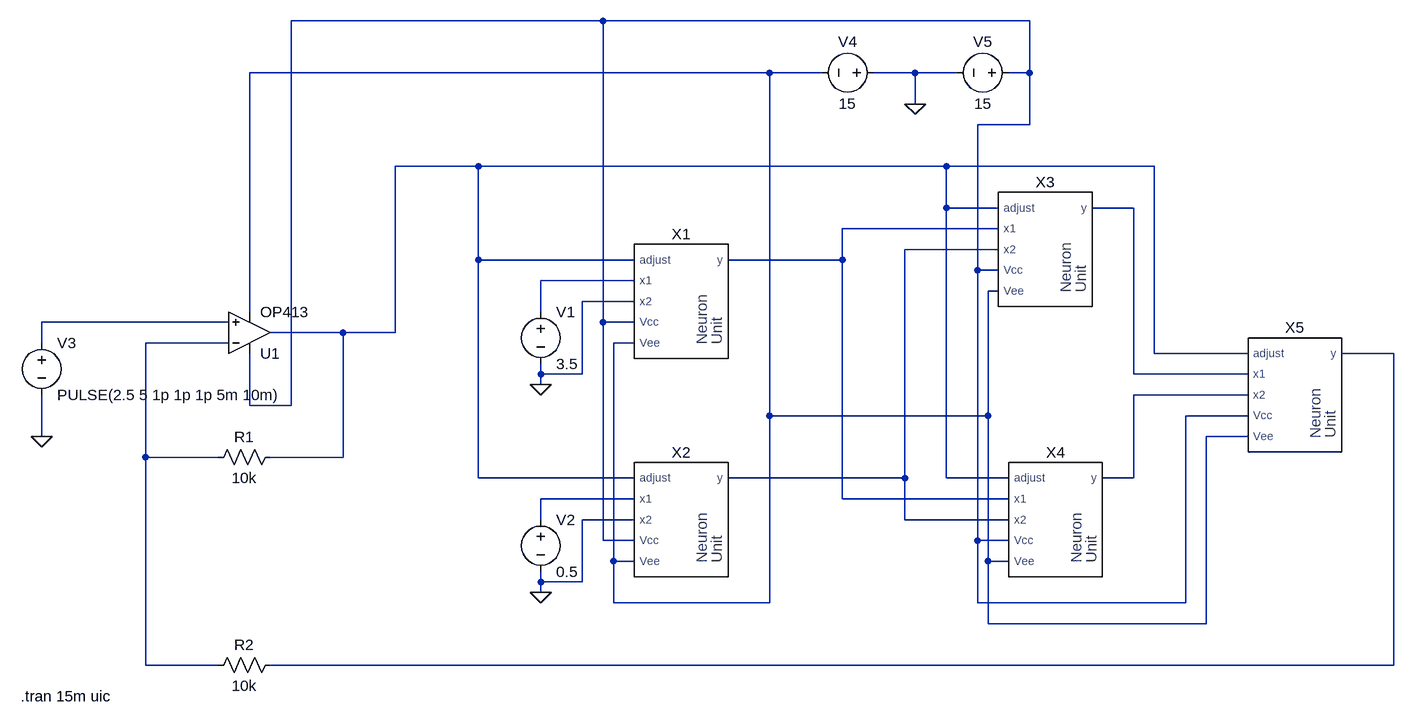
[diagram p0: schematic Network.asc]
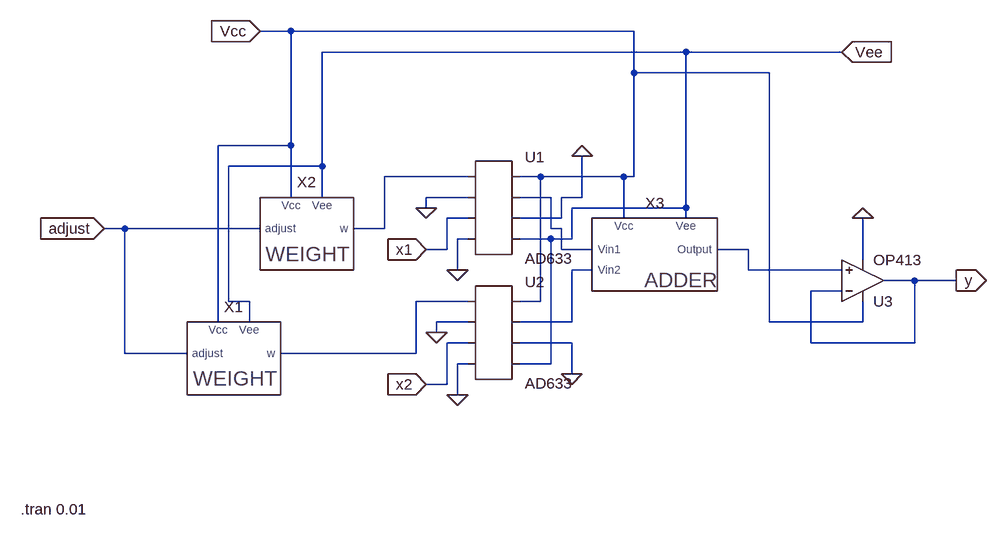
[diagram p1: sub-circuit neuron_unit.asc]
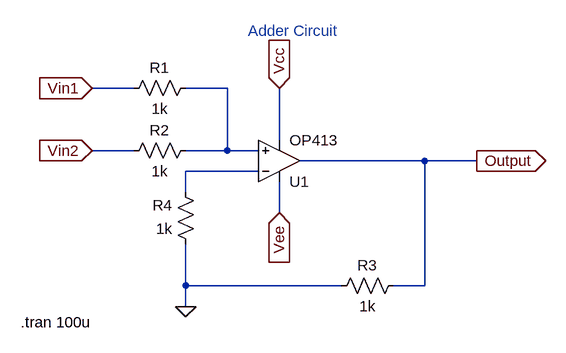
[diagram p2: sub-circuit adder.asc]
Network.asc, the LTspice schematic file:
Version 4
SHEET 1 880 680
WIRE -496 -384 -976 -384
WIRE 160 -384 -496 -384
WIRE -240 -304 -1040 -304
WIRE -160 -304 -240 -304
WIRE -16 -304 -80 -304
WIRE 48 -304 -16 -304
WIRE 160 -304 160 -384
WIRE 160 -304 128 -304
WIRE -16 -256 -16 -304
WIRE 160 -224 160 -304
WIRE 160 -224 80 -224
WIRE -688 -160 -816 -160
WIRE 32 -160 -688 -160
WIRE 352 -160 32 -160
WIRE 32 -96 32 -160
WIRE 112 -96 32 -96
WIRE 320 -96 256 -96
WIRE 112 -64 -128 -64
WIRE 112 -32 -32 -32
WIRE -688 -16 -688 -160
WIRE -448 -16 -688 -16
WIRE -128 -16 -128 -64
WIRE -128 -16 -304 -16
WIRE 80 0 80 -224
WIRE 112 0 80 0
WIRE -448 16 -592 16
WIRE 112 32 96 32
WIRE -448 48 -528 48
WIRE -1040 64 -1040 -304
WIRE -592 64 -592 16
WIRE -1072 80 -1360 80
WIRE -496 80 -496 -384
WIRE -448 80 -496 80
WIRE -896 96 -1008 96
WIRE -816 96 -816 -160
WIRE -816 96 -896 96
WIRE -1360 112 -1360 80
WIRE -1072 112 -1200 112
WIRE -448 112 -480 112
WIRE 352 128 352 -160
WIRE 496 128 352 128
WIRE 720 128 640 128
WIRE -592 160 -592 144
WIRE -528 160 -528 48
WIRE -528 160 -592 160
WIRE 320 160 320 -96
WIRE 496 160 320 160
WIRE -592 176 -592 160
WIRE 496 192 320 192
WIRE -1040 208 -1040 128
WIRE -976 208 -976 -384
WIRE -976 208 -1040 208
WIRE -240 224 -240 -304
WIRE 96 224 96 32
WIRE 96 224 -240 224
WIRE 496 224 400 224
WIRE -1360 256 -1360 192
WIRE 496 256 432 256
WIRE -1200 288 -1200 112
WIRE -1088 288 -1200 288
WIRE -896 288 -896 96
WIRE -896 288 -1008 288
WIRE -688 320 -688 -16
WIRE -448 320 -688 320
WIRE -32 320 -32 -32
WIRE -32 320 -304 320
WIRE 32 320 32 -96
WIRE 128 320 32 320
WIRE 320 320 320 192
WIRE 320 320 272 320
WIRE -448 352 -592 352
WIRE -128 352 -128 -16
WIRE 128 352 -128 352
WIRE -592 384 -592 352
WIRE -448 384 -528 384
WIRE -32 384 -32 320
WIRE 128 384 -32 384
WIRE -496 416 -496 80
WIRE -448 416 -496 416
WIRE 80 416 80 0
WIRE 128 416 80 416
WIRE -480 448 -480 112
WIRE -448 448 -480 448
WIRE 96 448 96 224
WIRE 128 448 96 448
WIRE -592 480 -592 464
WIRE -528 480 -528 384
WIRE -528 480 -592 480
WIRE -592 496 -592 480
WIRE -480 512 -480 448
WIRE -240 512 -240 224
WIRE -240 512 -480 512
WIRE 80 512 80 416
WIRE 400 512 400 224
WIRE 400 512 80 512
WIRE 96 544 96 448
WIRE 432 544 432 256
WIRE 432 544 96 544
WIRE -1200 608 -1200 288
WIRE -1088 608 -1200 608
WIRE 720 608 720 128
WIRE 720 608 -1008 608
FLAG -16 -256 0
FLAG -592 176 0
FLAG -592 496 0
FLAG -1360 256 0
SYMBOL neuron_unit -384 48 R0
SYMATTR InstName X1
SYMBOL neuron_unit -384 384 R0
SYMATTR InstName X2
SYMBOL neuron_unit 176 -32 R0
SYMATTR InstName X3
SYMBOL neuron_unit 192 384 R0
SYMATTR InstName X4
SYMBOL neuron_unit 560 192 R0
SYMATTR InstName X5
SYMBOL voltage -592 48 R0
WINDOW 123 0 0 Left 0
WINDOW 39 0 0 Left 0
SYMATTR InstName V1
SYMATTR Value 3.5
SYMBOL voltage -592 368 R0
WINDOW 123 0 0 Left 0
WINDOW 39 0 0 Left 0
SYMATTR InstName V2
SYMATTR Value 0.5
SYMBOL res -992 272 R90
WINDOW 0 0 56 VBottom 2
WINDOW 3 32 56 VTop 2
SYMATTR InstName R1
SYMATTR Value 10k
SYMBOL res -992 592 R90
WINDOW 0 0 56 VBottom 2
WINDOW 3 32 56 VTop 2
SYMATTR InstName R2
SYMATTR Value 10k
SYMBOL voltage -1360 96 R0
WINDOW 123 0 0 Left 0
WINDOW 39 0 0 Left 0
SYMATTR InstName V3
SYMATTR Value PULSE(2.5 5 1p 1p 1p 5m 10m)
SYMBOL voltage -64 -304 R90
WINDOW 0 -32 56 VBottom 2
WINDOW 3 32 56 VTop 2
WINDOW 123 0 0 Left 0
WINDOW 39 0 0 Left 0
SYMATTR InstName V4
SYMATTR Value 15
SYMBOL voltage 144 -304 R90
WINDOW 0 -32 56 VBottom 2
WINDOW 3 32 56 VTop 2
WINDOW 123 0 0 Left 0
WINDOW 39 0 0 Left 0
SYMATTR InstName V5
SYMATTR Value 15
SYMBOL OpAmps\\OP413 -1040 160 M180
SYMATTR InstName U1
TEXT -1392 656 Left 2 !.tran 15m uic

neuron_unit.asc, the sub-circuit schematic file:
Version 4
SHEET 1 1096 680
WIRE 0 -208 -48 -208
WIRE 528 -208 0 -208
WIRE 608 -176 48 -176
WIRE 848 -176 608 -176
WIRE 528 -144 528 -208
WIRE 736 -144 528 -144
WIRE 0 -32 0 -208
WIRE 0 -32 -112 -32
WIRE 48 0 48 -176
WIRE 48 0 -96 0
WIRE 272 16 144 16
WIRE 384 16 352 16
WIRE 512 16 384 16
WIRE 528 16 528 -144
WIRE 528 16 512 16
WIRE 0 48 0 -32
WIRE 48 48 48 0
WIRE 272 48 208 48
WIRE 400 48 352 48
WIRE 448 48 448 -16
WIRE 448 48 416 48
WIRE 208 64 208 48
WIRE 608 64 608 -176
WIRE 608 64 432 64
WIRE 272 80 240 80
WIRE 416 80 416 48
WIRE 416 80 352 80
WIRE 512 80 512 16
WIRE 608 80 608 64
WIRE -256 96 -288 96
WIRE -48 96 -256 96
WIRE 144 96 144 16
WIRE 144 96 96 96
WIRE 400 96 400 48
WIRE 416 96 400 96
WIRE 272 112 256 112
WIRE 400 112 352 112
WIRE 432 112 432 64
WIRE 432 112 400 112
WIRE 240 128 240 80
WIRE 240 128 208 128
WIRE 416 128 416 96
WIRE 464 128 416 128
WIRE 704 128 656 128
WIRE 880 144 880 80
WIRE 256 160 256 112
WIRE 464 160 432 160
WIRE 704 160 704 128
WIRE 848 160 704 160
WIRE 960 176 912 176
WIRE 1024 176 960 176
WIRE 848 192 800 192
WIRE -96 208 -96 0
WIRE -64 208 -96 208
WIRE 272 208 192 208
WIRE 384 208 384 16
WIRE 384 208 352 208
WIRE -112 240 -112 -32
WIRE -64 240 -64 208
WIRE 272 240 224 240
WIRE 432 240 432 160
WIRE 432 240 352 240
WIRE 736 240 736 -144
WIRE 880 240 880 208
WIRE 880 240 736 240
WIRE 224 256 224 240
WIRE 272 272 240 272
WIRE 432 272 352 272
WIRE 800 272 800 192
WIRE 960 272 960 176
WIRE 960 272 800 272
WIRE -256 288 -256 96
WIRE -160 288 -256 288
WIRE 192 288 192 208
WIRE 192 288 -16 288
WIRE 272 304 256 304
WIRE 400 304 400 112
WIRE 400 304 352 304
WIRE 432 320 432 272
WIRE 240 336 240 272
WIRE 240 336 208 336
WIRE 256 352 256 304
FLAG -48 -208 Vcc
IOPIN -48 -208 In
FLAG 848 -176 Vee
IOPIN 848 -176 In
FLAG 208 64 0
FLAG 224 256 0
FLAG 256 352 0
FLAG 256 160 0
FLAG 208 128 x1
IOPIN 208 128 In
FLAG 208 336 x2
IOPIN 208 336 In
FLAG -288 96 adjust
IOPIN -288 96 In
FLAG 448 -16 0
FLAG 432 320 0
FLAG 880 80 0
FLAG 1024 176 y
IOPIN 1024 176 Out
SYMBOL Weight -96 288 R0
SYMATTR InstName X1
SYMBOL Weight 16 96 R0
SYMATTR InstName X2
SYMBOL Adder 560 144 R0
SYMATTR InstName X3
SYMBOL OpAmps\\OP413 880 240 M180
SYMATTR InstName U3
SYMBOL AutoGenerated\\AD633 304 64 R0
SYMATTR InstName U1
SYMBOL AutoGenerated\\AD633 304 256 R0
SYMATTR InstName U2
TEXT -416 528 Left 2 !.tran 0.01

adder.asc, the sub-circuit schematic file:
Version 4
SHEET 1 880 680
WIRE -176 -48 -240 -48
WIRE -32 -48 -96 -48
WIRE 48 32 48 -48
WIRE -176 48 -240 48
WIRE -32 48 -32 -48
WIRE -32 48 -96 48
WIRE 16 48 -32 48
WIRE 272 64 80 64
WIRE 352 64 272 64
WIRE 16 80 -96 80
WIRE -96 112 -96 80
WIRE 48 144 48 96
WIRE -96 256 -96 192
WIRE 144 256 -96 256
WIRE 272 256 272 64
WIRE 272 256 224 256
WIRE -96 288 -96 256
FLAG -96 288 0
FLAG 352 64 Output
IOPIN 352 64 Out
FLAG -240 -48 Vin1
IOPIN -240 -48 In
FLAG -240 48 Vin2
IOPIN -240 48 In
FLAG 48 -48 Vcc
IOPIN 48 -48 In
FLAG 48 144 Vee
IOPIN 48 144 In
SYMBOL res -80 -64 R90
WINDOW 0 0 56 VBottom 2
WINDOW 3 32 56 VTop 2
SYMATTR InstName R1
SYMATTR Value 1k
SYMBOL res -80 32 R90
WINDOW 0 0 56 VBottom 2
WINDOW 3 32 56 VTop 2
SYMATTR InstName R2
SYMATTR Value 1k
SYMBOL res 240 240 R90
WINDOW 0 0 56 VBottom 2
WINDOW 3 32 56 VTop 2
SYMATTR InstName R3
SYMATTR Value 1k
SYMBOL res -80 208 R180
WINDOW 0 36 76 Left 2
WINDOW 3 36 40 Left 2
SYMATTR InstName R4
SYMATTR Value 1k
SYMBOL OpAmps\\OP413 48 128 M180
SYMATTR InstName U1
TEXT 0 -136 Left 2 ;Adder Circuit
TEXT -350 312 Left 2 !.tran 100u

The netlist it stands for:
* Network.asc
XX1 N003 N001 N002 N007 0 N005 neuron_unit
XX2 N003 N001 N002 N012 0 N006 neuron_unit
XX3 N003 N001 N002 N005 N006 N004 neuron_unit
XX4 N003 N001 N002 N005 N006 N011 neuron_unit
XX5 N003 N001 N002 N004 N011 N010 neuron_unit
V1 N007 0 3.5
V2 N012 0 0.5
R1 N003 N009 10k
R2 N010 N009 10k
V3 N008 0 PULSE(2.5 5 1p 1p 1p 5m 10m)
V4 0 N002 15
V5 N001 0 15
XU1 N008 N009 N001 N002 N003 OP413  ; pins In+ In- V+ V- OUT

* block symbol definitions
.subckt neuron_unit adjust Vcc Vee x1 x2 y
XX1 adjust Vcc Vee N005 Weight  ; pins adjust Vcc Vee w
XX2 adjust Vcc Vee N001 Weight  ; pins adjust Vcc Vee w
XX3 Vcc Vee N002 N004 N003 adder
XU3 N003 y Vcc 0 y OP413  ; pins In+ In- V+ V- OUT
* U1: AD633 (symbol AutoGenerated\AD633 not available, pins judged from their places): pin1=N001 pin2=0 pin3=x1 pin4=0 pin5=Vcc pin6=N002 pin7=0 pin8=Vee
* U2: AD633 (symbol AutoGenerated\AD633 not available, pins judged from their places): pin1=N005 pin2=0 pin3=x2 pin4=0 pin5=Vcc pin6=N004 pin7=0 pin8=Vee
.tran 0.01
.ends neuron_unit

.subckt adder Vcc Vee Vin1 Vin2 Output
R1 N001 Vin1 1k
R2 N001 Vin2 1k
R3 Output 0 1k
R4 0 N002 1k
XU1 N001 N002 Vee Vcc Output OP413  ; pins In+ In- V+ V- OUT
* Adder Circuit
.tran 100u
.ends adder

.tran 15m uic
.backanno
.end